# Altium schematic sheet MotorControl.SchDoc: Motor Control
size A4; Organization: Autobot Limited; Address1: 96, boulevard Bessiere; Address4: 75017 PARIS; SheetNumber: 2
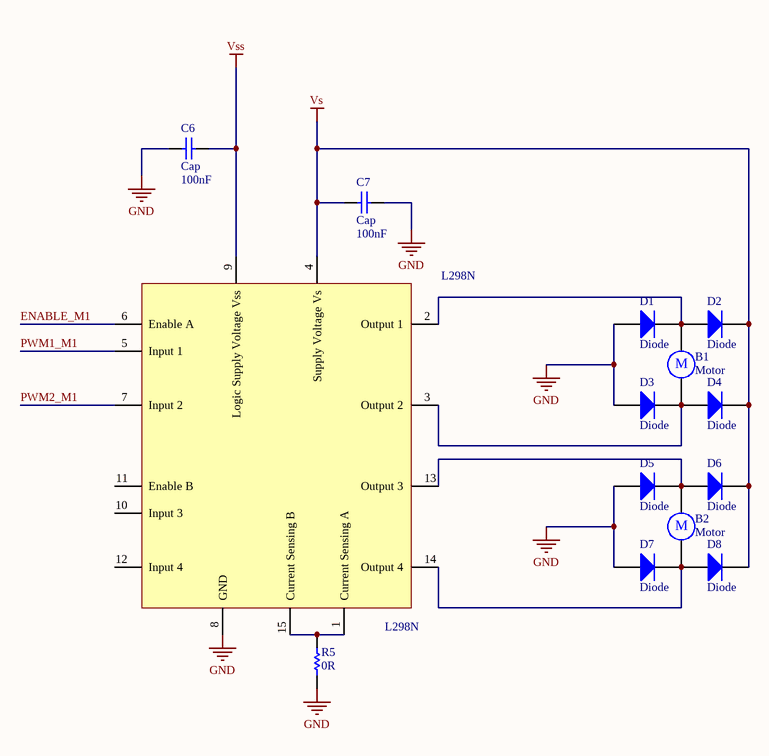
[diagram p0: MotorControl.SchDoc]

## Parts
B1  Motor  [RB5-10.5]
B2  Motor  [RB5-10.5]
C6  Cap  value 100nF  [RAD-0.3]
C7  Cap  value 100nF  [RAD-0.3]
D1  Diode  [SMC]
D2  Diode  [SMC]
D3  Diode  [SMC]
D4  Diode  [SMC]
D5  Diode  [SMC]
D6  Diode  [SMC]
D7  Diode  [SMC]
D8  Diode  [SMC]
L298N  L298N  [L298N]
R5  0R  [AXIAL-0.3]

## Nets
GND: C6.2 C7.2 D1.1(A) D3.1(A) D5.1(A) D7.1(A) L298N.8(GND) R5.1
Vs: C7.1 D2.2(K) D4.2(K) D6.2(K) D8.2(K) L298N.4(Supply_Voltage_Vs)
Vss: C6.1 L298N.9(Logic_Supply_Voltage_Vss)
ENABLE_M1: L298N.6(Enable_A)
PWM1_M1: L298N.5(Input_1)
PWM2_M1: L298N.7(Input_2)
NetB1_1: B1.1 D1.2(K) D2.1(A) L298N.2(Output_1)
NetB1_2: B1.2 D3.2(K) D4.1(A) L298N.3(Output_2)
NetB2_1: B2.1 D5.2(K) D6.1(A) L298N.13(Output_3)
NetB2_2: B2.2 D7.2(K) D8.1(A) L298N.14(Output_4)
NetL298N_1: L298N.1(Current_Sensing_A) L298N.15(Current_Sensing_B) R5.2

Not connected (* = marked no-connect by the designer): L298N 10(Input_3) 11(Enable_B) 12(Input_4)

## Notes on the sheet
- Title
- Size:
- Date:
- A4
- Number:
- Time:
- Revision:
- Sheet
- of
- File:
- (in symbol Motor) M

## Library data of the parts
B1 B2 = Motor: Motor, General Kind; Fournisseur: Olimex; Published: 24-Mar-1999; LatestRevisionDate: 17-Jul-2002; LatestRevisionNote: Re-released for DXP Platform.; PackageReference: RB5-10.5; Publisher: Altium Limited; PackageDescription: Capacitor (Radial); 2 Leads
C6 C7 = Cap: Capacitor; Published: 8-Jun-2000; LatestRevisionDate: 17-Jul-2002; LatestRevisionNote: Re-released for DXP Platform.; PackageReference: RAD-0.3; Publisher: Altium Limited; PackageDescription: Radial Cap, Thru-Hole; 2 Leads; 0.3 in Pin Spacing
D1-D8 = Diode: Default Diode; Fabricant: DIODES INC.; Fournisseur: Farnell; RefFabricant: MURS140-13-F; RefFournisseur: 1858656; Published: 8-Jun-2000; LatestRevisionDate: 17-Jul-2002; LatestRevisionNote: Re-released for DXP Platform.; PackageVersion: Sep-1996; PackageReference: SMC; Publisher: Altium Limited; PackageDescription: DO-214-AB/SMC; 2 C-Bend Leads; Body 7.9 x 5.9 mm, inc. leads (LxW); Code_JEDEC: DO-214-AB
L298N = L298N: Fabricant: STMICROELECTRONICS; Fournisseur: Farnell; RefFournisseur: 403295; RefFabricant: L298N
R5 = Res1: Resistor; Published: 8-Jun-2000; LatestRevisionDate: 17-Jul-2002; LatestRevisionNote: Re-released for DXP Platform.; PackageReference: AXIAL-0.3; Publisher: Altium Limited; PackageDescription: Axial Device, Thru-Hole; 2 Leads; 0.3 in Pin Spacing; Value: 0R